# EAGLE design 24LC256 (EAGLE 7.7.0)
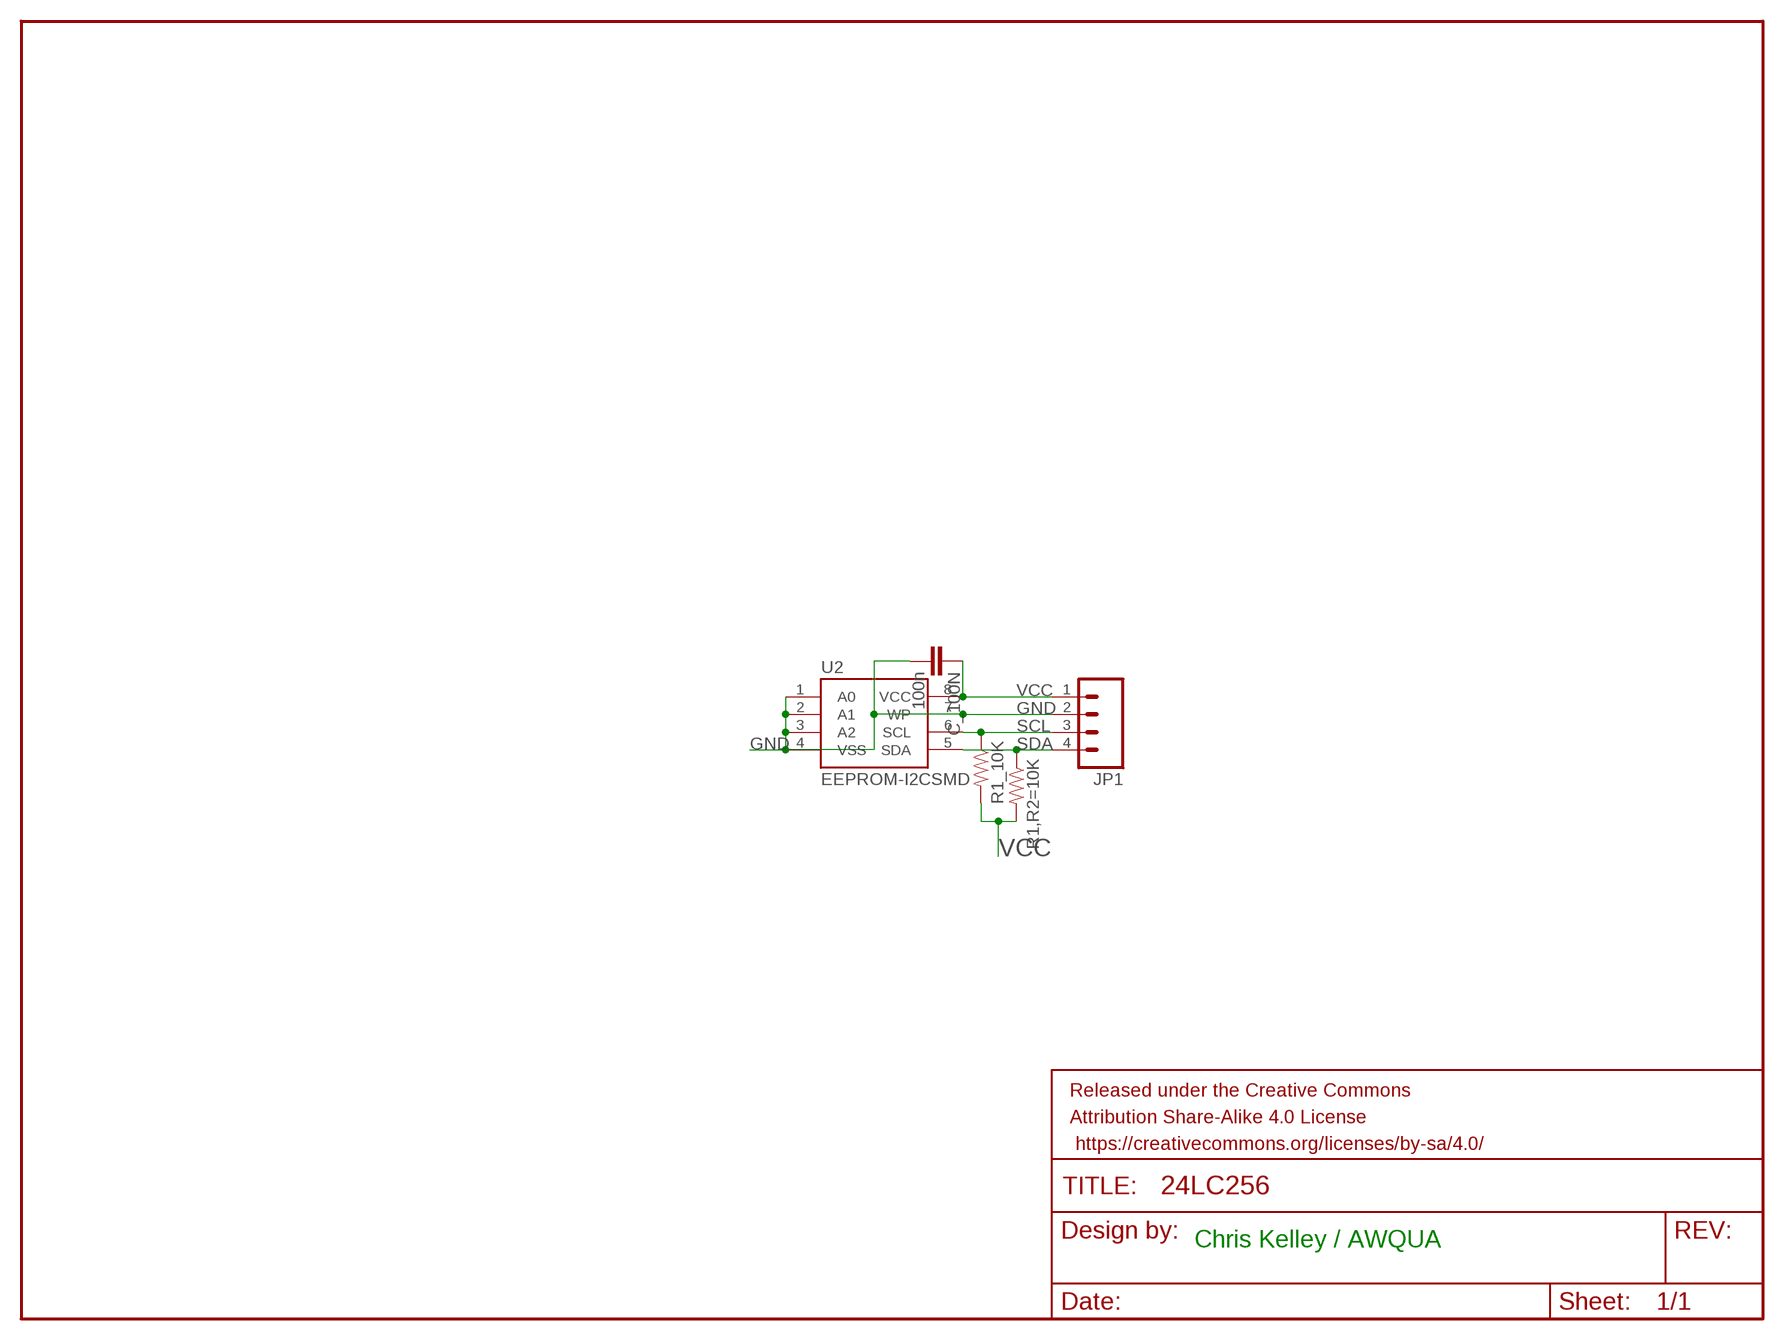
[diagram p0: schematic, sheet 1]

## Parts
C_100N  100n  CAP0603-CAP  [0603-CAP]
FRAME1  FRAME-LETTER  [CREATIVE_COMMONS]
JP1  M04PTH  [1X04]
R1,R2=10K  RESISTOR0603-RES  [0603-RES]
R1_10K  RESISTOR0603-RES  [0603-RES]
U2  EEPROM-I2CSMD  [SO08]

## Nets
GND: C_100N.2 JP1.2 U2.1(A0) U2.2(A1) U2.3(A2) U2.4(VSS) U2.7(WP)
SCL: JP1.3 R1_10K.1 U2.6(SCL)
SDA: JP1.4 R1,R2=10K.1 U2.5(SDA)
VCC: C_100N.1 JP1.1 R1,R2=10K.2 R1_10K.2 U2.8(VCC)

## Notes on the sheet
- Chris Kelley / AWQUA

## Library data of the parts
C_100N = SparkFun:CAP: Capacitor Standard 0603 ceramic capacitor, and 0.1" leaded capacitor.
FRAME1 = SparkFun-Aesthetics:FRAME-LETTER: Schematic Frame Standard 8.5x11 US Letter frame
JP1 = SparkFun-Connectors:M04: Header 4 Standard 4-pin 0.1" header. Use with straight break away headers (SKU : PRT-00116), right angle break away headers (PRT-00553), swiss pins (PRT-00743), machine pins (PRT-00117), and female headers (PRT-00115). Molex polarized connector foot print use with SKU : PRT-08231 with associated crimp pins and housings. 1MM SMD Version SKU: PRT-10208
R1,R2=10K R1_10K = SparkFun-Passives:RESISTOR: Resistor Basic schematic elements and footprints for 0603, 1206, and PTH resistors.
U2 = SparkFun-DigitalIC:EEPROM-I2C: I2C EEPROM chips, 24LC256 (and others)

## Board
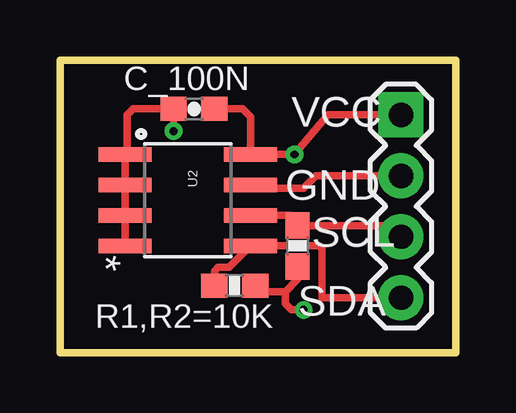
[diagram p1: board, top side]
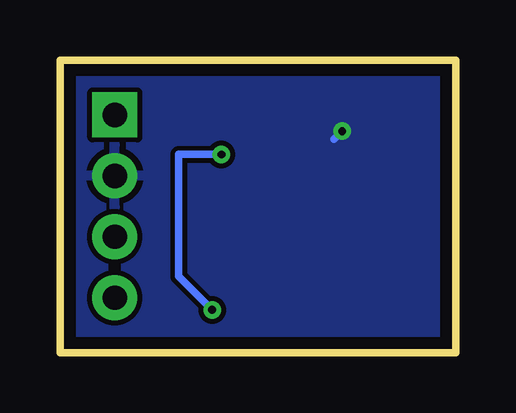
[diagram p2: board, bottom side, seen from below]

Size 16.51 x 12.19 mm. Coordinates in mm from the lower left corner, seen from the top.
Outline: 16.51,12.19 0,12.19 0,0 16.51,0 16.51,12.19
Copper layers (1*16): Top 0.035mm / dielectric 1.5mm / Bottom 0.035mm
Design rules "default *": minimum track width 10mil, minimum drill 24mil, track to track 8mil, track to pad 8mil, pad to pad 8mil, via to via 8mil, smd to smd 8mil, copper to edge 20mil, drill to drill 8mil, minimum pad ring 10mil, minimum via ring 8mil, stop-mask expansion 4mil, vias tented up to drill 13mil, thermal gap 10mil

### Footprints (pad centres in the part's own frame; a part is rotated, then mirrored left to right if it is on the bottom)
0603-CAP = smd 1.1 x 1: 1 -0.85,0; 2 0.85,0
1X04 = drill 1.016 pad 1.88 square: 1 0,0 | drill 1.016 pad 1.88: 2 2.54,0; 3 5.08,0; 4 7.62,0
0603-RES = smd 1.1 x 1: 1 -0.85,0; 2 0.85,0
SO08 = smd 0.61 x 2.21: 1 -1.905,-2.616; 2 -0.635,-2.616; 3 0.635,-2.616; 4 1.905,-2.616; 5 1.905,2.616; 6 0.635,2.616; 7 -0.635,2.616; 8 -1.905,2.616

### Placement (x,y rotation side)
C_100N  5.59,10.16 180 top
FRAME1  -12.19,-10.16 0 top  (outside the outline)
JP1  14.22,9.91 270 top
R1,R2=10K  7.29,2.79 0 top
R1_10K  9.91,4.45 270 top
U2  5.33,6.35 270 top

### Tracks (layer width: path | path; a pad name or v marks a point on that pad's centre or on a via)
GND  (via drill 0.33)
  Top 0.305: U2.4 U2.3 U2.2 U2.1 2.79,8.33 2.79,9.91 3.05,10.16 C_100N.2 v4.74,9.23 | JP1.2 10.67,7.37 10.16,6.86 8.08,6.86 U2.7
  Bottom 0.305: v4.74,9.23 5.08,8.89
  pour Bottom: -2.54,21.08 27.94,21.08 27.94,-1.78 -2.54,-1.78
SCL
  Top 0.305: U2.6 9.61,5.71 9.61,5.59 R1_10K.1 13.76,5.29 JP1.3
SDA
  Top 0.305: JP1.4 10.92,2.29 10.92,4.32 10.79,4.45 U2.5 7.06,3.56 6.6,3.56 6.44,3.39 R1,R2=10K.1
VCC  (via drill 0.33)
  Top 0.305: JP1.1 11.18,9.91 v9.78,8.26 U2.8 7.95,9.83 7.62,10.16 C_100N.1 | R1_10K.2 9.91,3.05 9.4,2.54 | 9.4,2.54 8.39,2.54 R1,R2=10K.2 | v10.16,1.78 9.65,1.78 9.4,2.03 9.4,2.54
  Bottom 0.305: v10.16,1.78 11.56,3.17 11.56,8.26 v9.78,8.26

### Text on the board
tPlace: Chris Kelley / AWQUA
tNames: VCC | GND | * | SCL | SDA